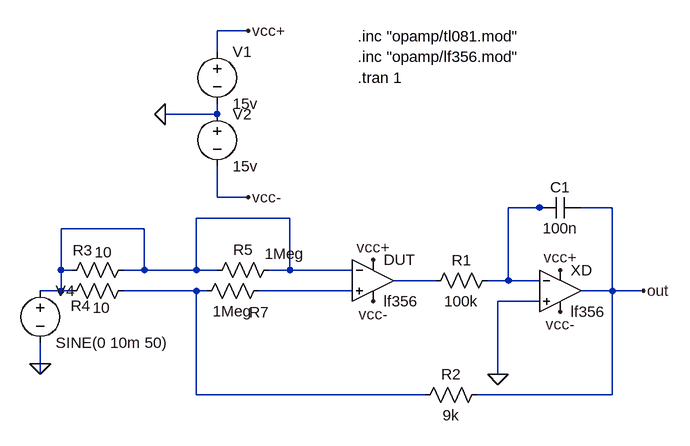
[diagram p0: schematic ej3.asc]
ej3.asc, the LTspice schematic file:
Version 4
SHEET 1 880 680
WIRE -64 -224 -112 -224
WIRE -112 -192 -112 -224
WIRE -112 -96 -112 -112
WIRE -112 -96 -192 -96
WIRE -112 32 -112 -16
WIRE -64 32 -112 32
WIRE 384 48 336 48
WIRE 400 48 384 48
WIRE 496 48 448 48
WIRE 0 64 -144 64
WIRE -224 80 -352 80
WIRE -352 144 -352 80
WIRE -336 144 -352 144
WIRE -224 144 -224 80
WIRE -224 144 -256 144
WIRE -144 144 -144 64
WIRE -144 144 -224 144
WIRE -112 144 -144 144
WIRE 0 144 0 64
WIRE 0 144 -32 144
WIRE 96 144 0 144
WIRE 224 160 160 160
WIRE 336 160 336 48
WIRE 336 160 304 160
WIRE 384 160 336 160
WIRE -352 176 -352 144
WIRE -352 176 -384 176
WIRE -336 176 -352 176
WIRE -144 176 -256 176
WIRE -128 176 -144 176
WIRE 96 176 -48 176
WIRE 496 176 496 48
WIRE 496 176 448 176
WIRE 544 176 496 176
WIRE 384 192 320 192
WIRE -384 288 -384 256
WIRE -384 304 -384 288
WIRE 320 304 320 192
WIRE -144 336 -144 176
WIRE 208 336 -144 336
WIRE 496 336 496 176
WIRE 496 336 288 336
FLAG 544 176 out
FLAG -64 -224 vcc+
FLAG 128 128 vcc+
FLAG 416 144 vcc+
FLAG -64 32 vcc-
FLAG 128 192 vcc-
FLAG 416 208 vcc-
FLAG -192 -96 0
FLAG -384 288 0
FLAG 320 304 0
SYMBOL Opamps\\opamp2 128 96 R0
SYMATTR InstName DUT
SYMATTR Value lf356
SYMBOL Opamps\\opamp2 416 112 R0
SYMATTR InstName XD
SYMATTR Value lf356
SYMBOL res 320 144 R90
WINDOW 0 0 56 VBottom 2
WINDOW 3 32 56 VTop 2
SYMATTR InstName R1
SYMATTR Value 100k
SYMBOL cap 448 32 R90
WINDOW 0 0 32 VBottom 2
WINDOW 3 32 32 VTop 2
SYMATTR InstName C1
SYMATTR Value 100n
SYMBOL res -240 128 R90
WINDOW 0 1 79 VBottom 2
WINDOW 3 -27 47 VTop 2
SYMATTR InstName R3
SYMATTR Value 10
SYMBOL res -240 160 R90
WINDOW 0 54 82 VBottom 2
WINDOW 3 26 50 VTop 2
SYMATTR InstName R4
SYMATTR Value 10
SYMBOL voltage -112 -208 R0
SYMATTR InstName V1
SYMATTR Value 15v
SYMBOL voltage -112 -112 R0
SYMATTR InstName V2
SYMATTR Value 15v
SYMBOL res -16 128 R90
WINDOW 0 0 56 VBottom 2
WINDOW 3 -25 -8 VTop 2
SYMATTR InstName R5
SYMATTR Value 1Meg
SYMBOL res -32 160 R90
WINDOW 0 64 15 VBottom 2
WINDOW 3 32 56 VTop 2
SYMATTR InstName R7
SYMATTR Value 1Meg
SYMBOL res 304 320 R90
WINDOW 0 0 56 VBottom 2
WINDOW 3 32 56 VTop 2
SYMATTR InstName R2
SYMATTR Value 9k
SYMBOL voltage -384 160 R0
WINDOW 123 0 0 Left 0
WINDOW 39 0 0 Left 0
SYMATTR InstName V4
SYMATTR Value SINE(0 10m 50)
TEXT 104 -216 Left 2 !.inc "opamp/tl081.mod"
TEXT 104 -184 Left 2 !.inc "opamp/lf356.mod"
TEXT 104 -152 Left 2 !.tran 1

The netlist it stands for:
* ej3.asc
XDUT N005 N002 vcc+ vcc- N003 lf356  ; pins In+ In- V+ V- OUT
XXD 0 N001 vcc+ vcc- out lf356  ; pins In+ In- V+ V- OUT
R1 N001 N003 100k
C1 out N001 100n
R3 N002 N002 10
R4 N004 N002 10
V1 vcc+ 0 15v
V2 0 vcc- 15v
R5 N002 N002 1Meg
R7 N005 N004 1Meg
R2 out N004 9k
V4 N002 0 SINE(0 10m 50)
.inc "opamp/tl081.mod"
.inc "opamp/lf356.mod"
.tran 1
.backanno
.end